# Altium schematic sheet Key.schdoc
size 51 x 32 mm
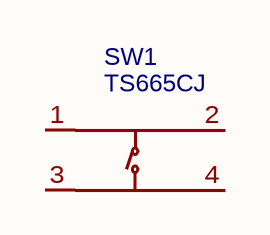
[diagram p0: Key.schdoc]

## Parts
SW1  TS665CJ  [SW-TH_4P-L6.0-W6.0-P4.50-LS6.5]

## Nets

Not connected (* = marked no-connect by the designer): SW1 1(A) 2(B) 3(C) 4(D)

## Library data of the parts
SW1 = TS665CJ: BOM_Manufacturer: SHOU HAN; Contributor: LCSC; BOM_Supplier: LCSC; BOM_Supplier Part: C393938; BOM_Manufacturer Part: TS665CJ; spicePre: S; spiceSymbolName: TS665CJ